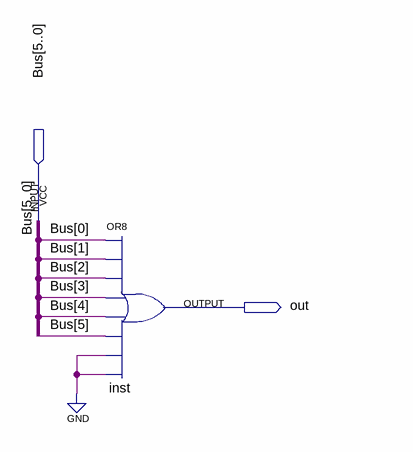
[diagram p0: schematic sheet]
// Quartus schematic BusOr.bdf as structural Verilog: 1 symbols, 2 pins
module BusOr (
  input  [5:0] Bus,
  output out
);

  or inst (out, Bus[0], Bus[1], Bus[2], Bus[3], Bus[4], Bus[5], 1'b0, 1'b0);
endmodule
